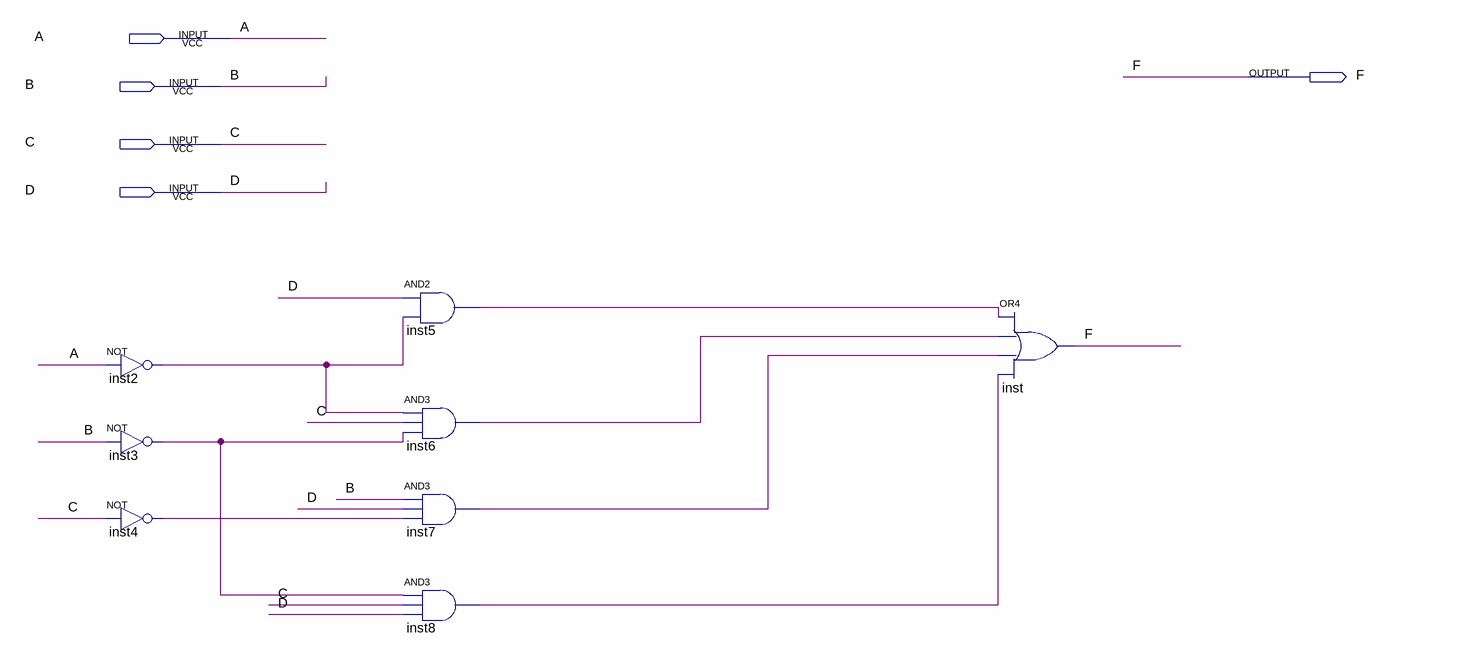
[diagram p0: schematic sheet]
// Quartus schematic circuit1.bdf as structural Verilog: 8 symbols, 5 pins
module circuit1 (
  input  A,
  input  B,
  input  C,
  input  D,
  output F
);

  wire inst2_out, inst3_out, inst4_out, inst5_out, inst6_out, inst7_out, inst8_out;

  not inst2 (inst2_out, A);
  not inst3 (inst3_out, B);
  not inst4 (inst4_out, C);
  and inst5 (inst5_out, D, inst2_out);
  and inst6 (inst6_out, inst2_out, C, inst3_out);
  and inst7 (inst7_out, B, D, inst4_out);
  and inst8 (inst8_out, inst3_out, C, D);
  or inst (F, inst5_out, inst6_out, inst7_out, inst8_out);
endmodule
